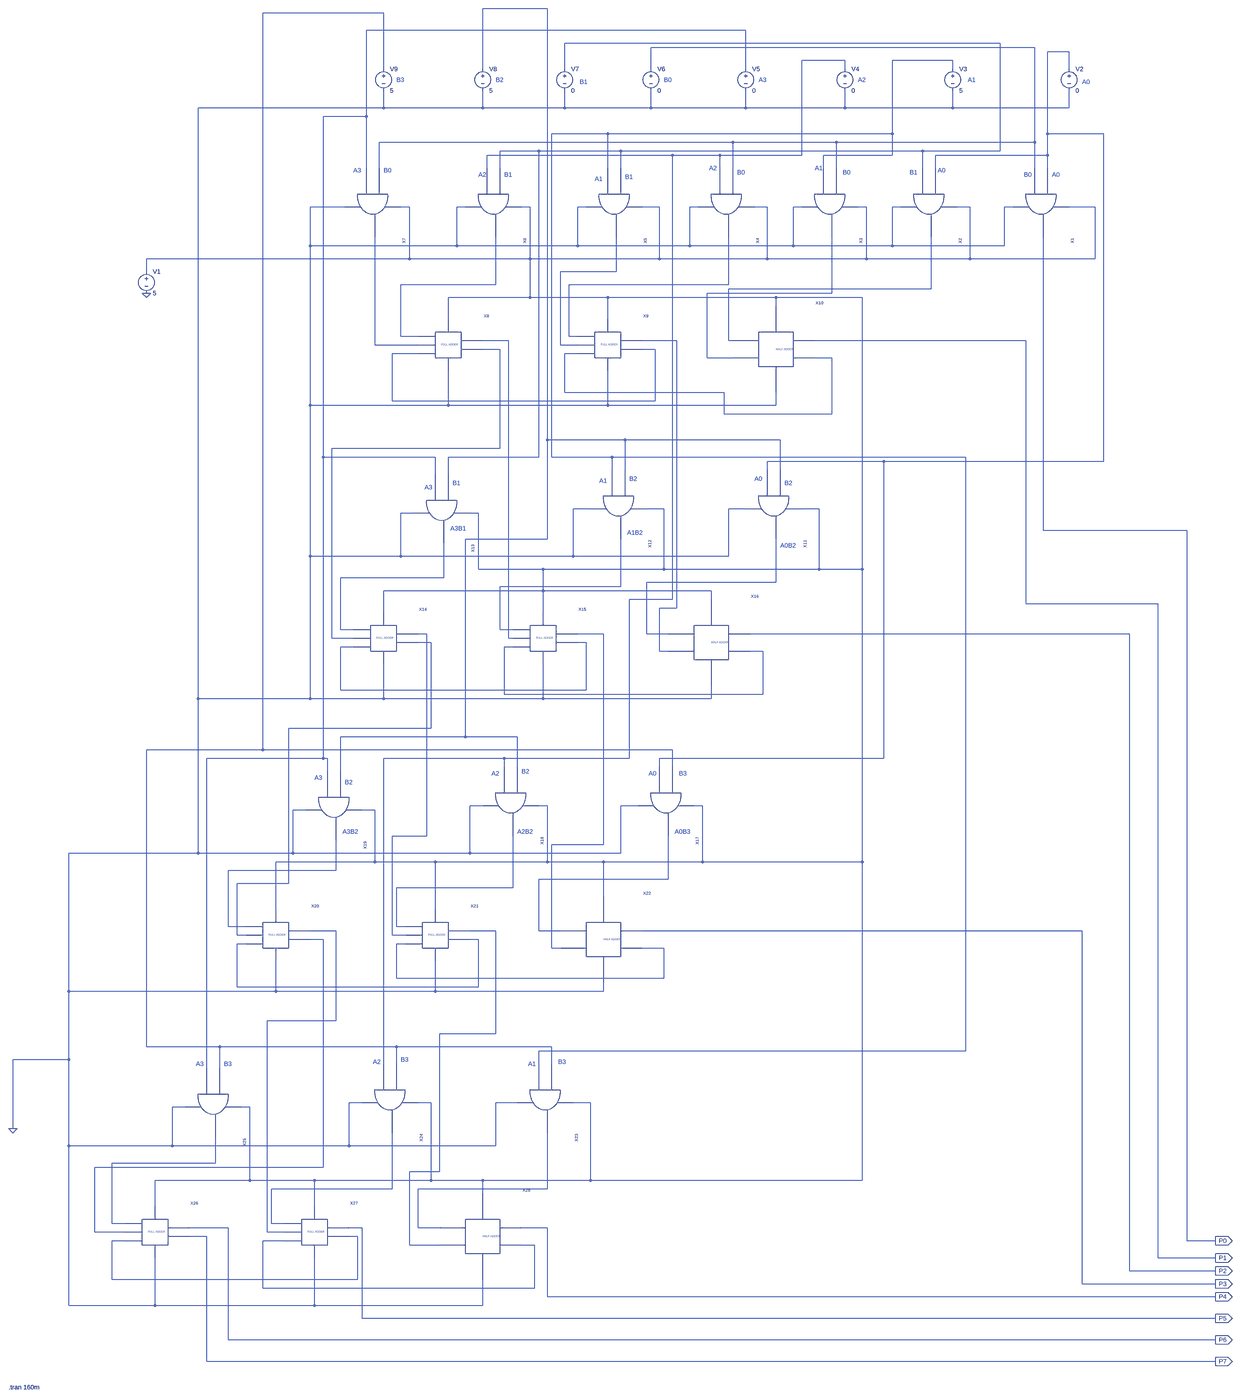
[diagram p0: schematic 4bitmultipliertesting.asc, whole sheet]
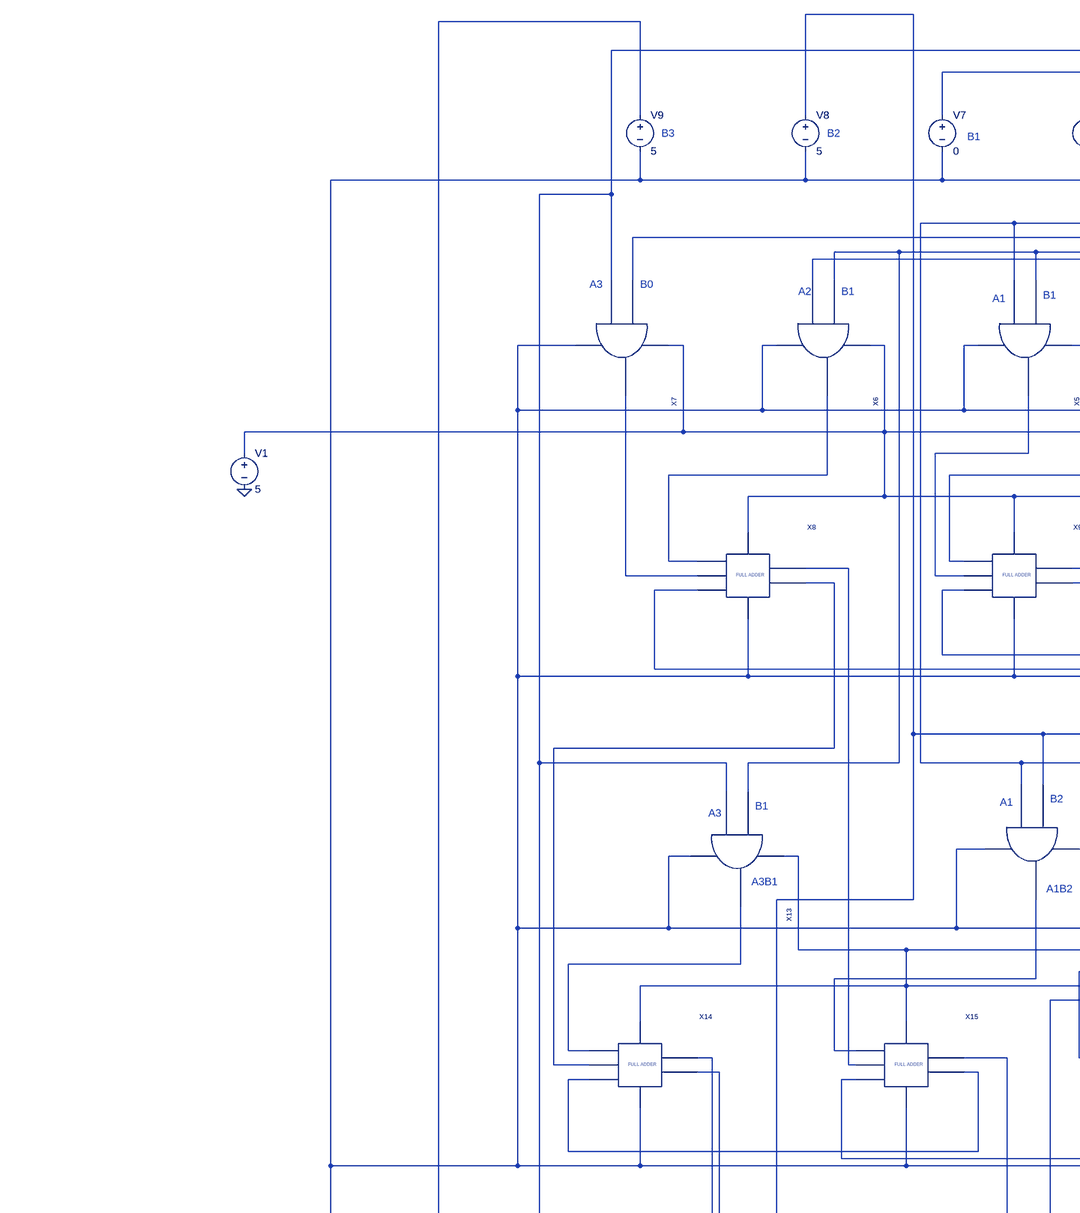
[diagram p1: schematic 4bitmultipliertesting.asc, part, row 1 of 2, column 1 of 2]
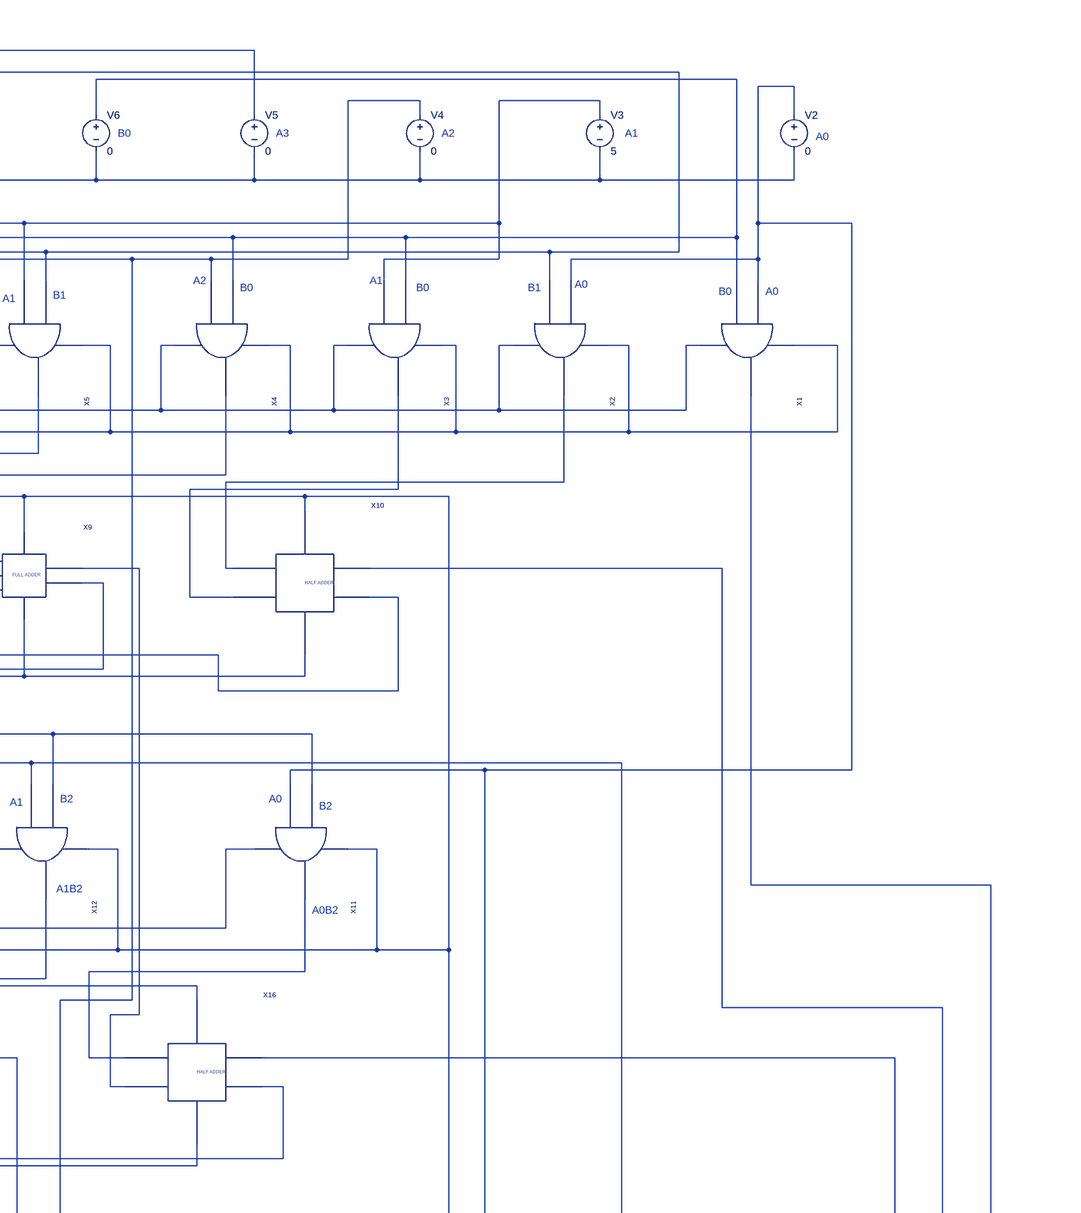
[diagram p2: schematic 4bitmultipliertesting.asc, part, row 1 of 2, column 2 of 2]
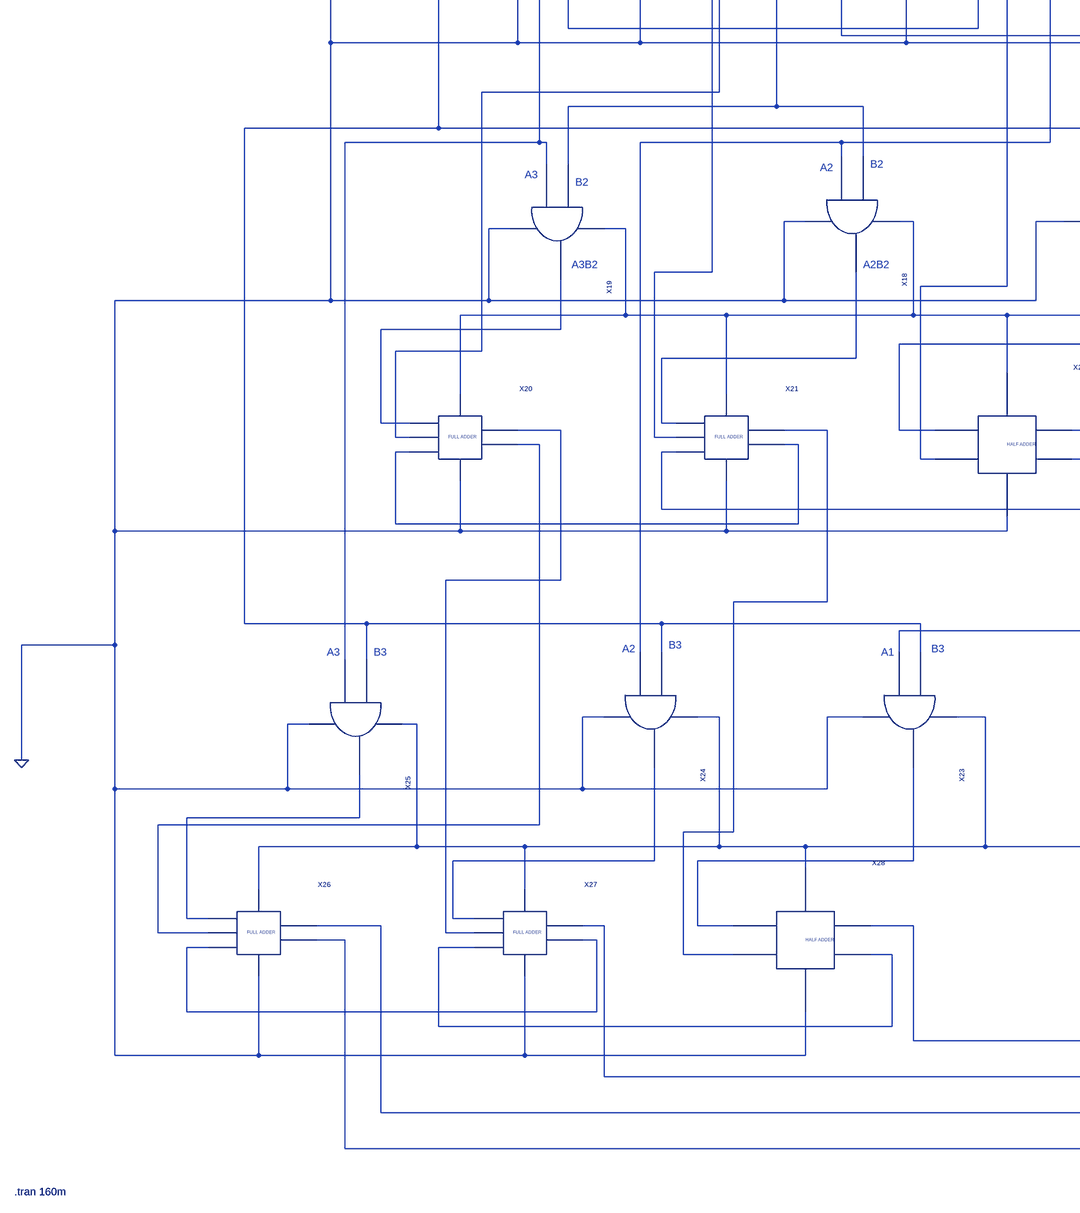
[diagram p3: schematic 4bitmultipliertesting.asc, part, row 2 of 2, column 1 of 2]
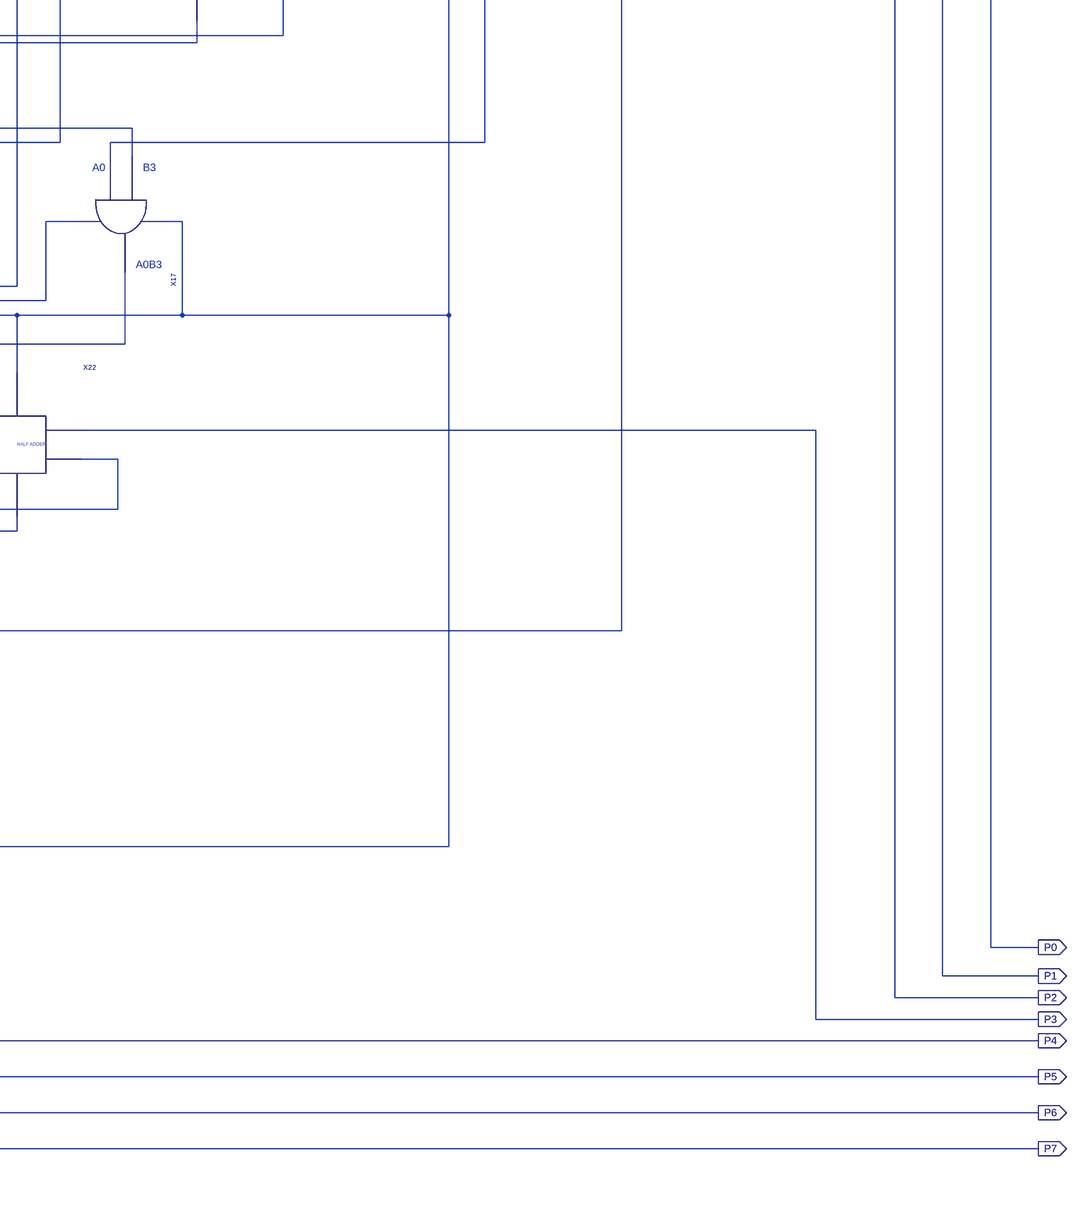
[diagram p4: schematic 4bitmultipliertesting.asc, part, row 2 of 2, column 2 of 2]
4bitmultipliertesting.asc, the LTspice schematic file:
Version 4
SHEET 1 880 680
WIRE -5856 -4944 -6096 -4944
WIRE -6464 -4928 -6912 -4928
WIRE -5120 -4864 -6528 -4864
WIRE -4176 -4816 -5792 -4816
WIRE -4048 -4800 -5472 -4800
WIRE -3920 -4784 -4000 -4784
WIRE -4752 -4752 -4912 -4752
WIRE -4352 -4752 -4576 -4752
WIRE -6464 -4720 -6464 -4928
WIRE -6096 -4720 -6096 -4944
WIRE -5792 -4720 -5792 -4816
WIRE -5472 -4720 -5472 -4800
WIRE -5120 -4720 -5120 -4864
WIRE -4752 -4720 -4752 -4752
WIRE -4352 -4720 -4352 -4752
WIRE -3920 -4720 -3920 -4784
WIRE -6464 -4576 -6464 -4640
WIRE -6464 -4576 -7152 -4576
WIRE -6096 -4576 -6096 -4640
WIRE -6096 -4576 -6464 -4576
WIRE -5792 -4576 -5792 -4640
WIRE -5792 -4576 -6096 -4576
WIRE -5472 -4576 -5472 -4640
WIRE -5472 -4576 -5792 -4576
WIRE -5120 -4576 -5120 -4640
WIRE -5120 -4576 -5472 -4576
WIRE -4752 -4576 -4752 -4640
WIRE -4752 -4576 -5120 -4576
WIRE -4352 -4576 -4352 -4640
WIRE -4352 -4576 -4752 -4576
WIRE -3920 -4576 -3920 -4640
WIRE -3920 -4576 -4352 -4576
WIRE -6528 -4544 -6528 -4864
WIRE -6528 -4544 -6688 -4544
WIRE -5632 -4480 -5840 -4480
WIRE -4576 -4480 -4576 -4752
WIRE -4576 -4480 -5632 -4480
WIRE -4000 -4480 -4000 -4784
WIRE -3792 -4480 -4000 -4480
WIRE -5168 -4448 -6480 -4448
WIRE -4784 -4448 -5168 -4448
WIRE -4048 -4448 -4048 -4800
WIRE -4048 -4448 -4784 -4448
WIRE -5888 -4416 -6032 -4416
WIRE -5584 -4416 -5888 -4416
WIRE -4464 -4416 -5584 -4416
WIRE -4176 -4416 -4176 -4816
WIRE -4176 -4416 -4464 -4416
WIRE -5392 -4400 -6080 -4400
WIRE -5216 -4400 -5392 -4400
WIRE -4912 -4400 -4912 -4752
WIRE -4912 -4400 -5216 -4400
WIRE -4576 -4400 -4576 -4480
WIRE -4576 -4400 -4832 -4400
WIRE -4000 -4400 -4000 -4480
WIRE -4000 -4400 -4416 -4400
WIRE -6528 -4352 -6528 -4544
WIRE -6480 -4352 -6480 -4448
WIRE -6080 -4352 -6080 -4400
WIRE -6032 -4352 -6032 -4416
WIRE -5632 -4352 -5632 -4480
WIRE -5584 -4352 -5584 -4416
WIRE -5216 -4352 -5216 -4400
WIRE -5168 -4352 -5168 -4448
WIRE -4832 -4352 -4832 -4400
WIRE -4784 -4352 -4784 -4448
WIRE -4464 -4352 -4464 -4416
WIRE -4416 -4352 -4416 -4400
WIRE -4048 -4352 -4048 -4448
WIRE -4000 -4352 -4000 -4400
WIRE -6608 -4208 -6736 -4208
WIRE -6368 -4208 -6400 -4208
WIRE -6160 -4208 -6192 -4208
WIRE -5920 -4208 -5952 -4208
WIRE -5712 -4208 -5744 -4208
WIRE -5440 -4208 -5504 -4208
WIRE -5296 -4208 -5328 -4208
WIRE -5040 -4208 -5088 -4208
WIRE -4912 -4208 -4944 -4208
WIRE -4672 -4208 -4704 -4208
WIRE -4544 -4208 -4576 -4208
WIRE -4288 -4208 -4336 -4208
WIRE -4128 -4208 -4160 -4208
WIRE -3824 -4208 -3920 -4208
WIRE -6736 -4064 -6736 -4208
WIRE -6192 -4064 -6192 -4208
WIRE -6192 -4064 -6736 -4064
WIRE -5744 -4064 -5744 -4208
WIRE -5744 -4064 -6192 -4064
WIRE -5328 -4064 -5328 -4208
WIRE -5328 -4064 -5744 -4064
WIRE -4944 -4064 -4944 -4208
WIRE -4944 -4064 -5328 -4064
WIRE -4576 -4064 -4576 -4208
WIRE -4576 -4064 -4944 -4064
WIRE -4160 -4064 -4160 -4208
WIRE -4160 -4064 -4576 -4064
WIRE -6368 -4016 -6368 -4208
WIRE -6368 -4016 -7344 -4016
WIRE -5920 -4016 -5920 -4208
WIRE -5920 -4016 -6368 -4016
WIRE -5440 -4016 -5440 -4208
WIRE -5440 -4016 -5920 -4016
WIRE -5040 -4016 -5040 -4208
WIRE -5040 -4016 -5440 -4016
WIRE -4672 -4016 -4672 -4208
WIRE -4672 -4016 -5040 -4016
WIRE -4288 -4016 -4288 -4208
WIRE -4288 -4016 -4672 -4016
WIRE -3824 -4016 -3824 -4208
WIRE -3824 -4016 -4288 -4016
WIRE -7344 -3968 -7344 -4016
WIRE -5600 -3968 -5600 -4096
WIRE -5600 -3968 -5808 -3968
WIRE -6048 -3920 -6048 -4096
WIRE -6048 -3920 -6400 -3920
WIRE -5184 -3920 -5184 -4096
WIRE -5184 -3920 -5776 -3920
WIRE -4432 -3904 -4432 -4096
WIRE -4432 -3904 -5184 -3904
WIRE -4800 -3888 -4800 -4096
WIRE -4800 -3888 -5264 -3888
WIRE -5920 -3872 -5920 -4016
WIRE -5920 -3872 -6224 -3872
WIRE -5632 -3872 -5920 -3872
WIRE -5008 -3872 -5632 -3872
WIRE -4688 -3872 -5008 -3872
WIRE -5008 -3840 -5008 -3872
WIRE -6224 -3792 -6224 -3872
WIRE -5632 -3792 -5632 -3872
WIRE -6400 -3728 -6400 -3920
WIRE -6336 -3728 -6400 -3728
WIRE -5776 -3728 -5776 -3920
WIRE -5744 -3728 -5776 -3728
WIRE -6000 -3712 -6096 -3712
WIRE -5376 -3712 -5504 -3712
WIRE -5184 -3712 -5184 -3904
WIRE -5168 -3712 -5184 -3712
WIRE -4080 -3712 -4864 -3712
WIRE -6496 -3696 -6496 -4096
WIRE -6336 -3696 -6496 -3696
WIRE -5808 -3696 -5808 -3968
WIRE -5744 -3696 -5808 -3696
WIRE -6032 -3680 -6096 -3680
WIRE -5456 -3680 -5504 -3680
WIRE -6336 -3664 -6432 -3664
WIRE -5744 -3664 -5792 -3664
WIRE -5264 -3648 -5264 -3888
WIRE -5168 -3648 -5264 -3648
WIRE -4800 -3648 -4864 -3648
WIRE -5792 -3520 -5792 -3664
WIRE -5200 -3520 -5792 -3520
WIRE -6432 -3488 -6432 -3664
WIRE -5456 -3488 -5456 -3680
WIRE -5456 -3488 -6432 -3488
WIRE -6736 -3472 -6736 -4064
WIRE -6224 -3472 -6224 -3600
WIRE -6224 -3472 -6736 -3472
WIRE -5632 -3472 -5632 -3600
WIRE -5632 -3472 -6224 -3472
WIRE -5008 -3472 -5008 -3520
WIRE -5008 -3472 -5632 -3472
WIRE -5200 -3440 -5200 -3520
WIRE -4800 -3440 -4800 -3648
WIRE -4800 -3440 -5200 -3440
WIRE -5856 -3344 -5856 -4944
WIRE -5568 -3344 -5856 -3344
WIRE -4992 -3344 -5568 -3344
WIRE -6032 -3312 -6032 -3680
WIRE -6032 -3312 -6656 -3312
WIRE -6688 -3280 -6688 -4544
WIRE -6272 -3280 -6688 -3280
WIRE -5888 -3280 -5888 -4416
WIRE -5888 -3280 -6224 -3280
WIRE -5840 -3280 -5840 -4480
WIRE -5616 -3280 -5840 -3280
WIRE -4304 -3280 -5616 -3280
WIRE -4608 -3264 -5040 -3264
WIRE -3792 -3264 -3792 -4480
WIRE -3792 -3264 -4608 -3264
WIRE -5616 -3232 -5616 -3280
WIRE -5568 -3232 -5568 -3344
WIRE -5040 -3232 -5040 -3264
WIRE -4992 -3232 -4992 -3344
WIRE -6272 -3216 -6272 -3280
WIRE -6224 -3216 -6224 -3280
WIRE -5696 -3088 -5760 -3088
WIRE -5424 -3088 -5488 -3088
WIRE -5120 -3088 -5184 -3088
WIRE -4848 -3088 -4912 -3088
WIRE -6352 -3072 -6400 -3072
WIRE -6112 -3072 -6144 -3072
WIRE -4016 -3008 -4016 -4096
WIRE -3056 -3008 -4016 -3008
WIRE -5856 -2976 -5856 -3344
WIRE -5856 -2976 -6160 -2976
WIRE -6736 -2912 -6736 -3472
WIRE -6400 -2912 -6400 -3072
WIRE -6400 -2912 -6736 -2912
WIRE -5760 -2912 -5760 -3088
WIRE -5760 -2912 -6400 -2912
WIRE -5184 -2912 -5184 -3088
WIRE -5184 -2912 -5760 -2912
WIRE -6112 -2864 -6112 -3072
WIRE -5872 -2864 -6112 -2864
WIRE -5424 -2864 -5424 -3088
WIRE -5424 -2864 -5872 -2864
WIRE -4848 -2864 -4848 -3088
WIRE -4848 -2864 -5424 -2864
WIRE -4688 -2864 -4688 -3872
WIRE -4688 -2864 -4848 -2864
WIRE -6240 -2832 -6240 -2960
WIRE -6240 -2832 -6624 -2832
WIRE -5008 -2816 -5008 -2976
WIRE -5008 -2816 -5488 -2816
WIRE -5584 -2800 -5584 -2976
WIRE -5584 -2800 -6032 -2800
WIRE -5872 -2784 -5872 -2864
WIRE -5872 -2784 -6464 -2784
WIRE -5248 -2784 -5872 -2784
WIRE -5392 -2752 -5392 -4400
WIRE -5392 -2752 -5552 -2752
WIRE -5248 -2752 -5248 -2784
WIRE -4080 -2736 -4080 -3712
WIRE -3424 -2736 -4080 -2736
WIRE -5376 -2720 -5376 -3712
WIRE -5376 -2720 -5440 -2720
WIRE -6464 -2704 -6464 -2784
WIRE -5872 -2704 -5872 -2784
WIRE -6624 -2640 -6624 -2832
WIRE -6576 -2640 -6624 -2640
WIRE -6032 -2640 -6032 -2800
WIRE -5984 -2640 -6032 -2640
WIRE -6304 -2624 -6336 -2624
WIRE -5648 -2624 -5744 -2624
WIRE -5488 -2624 -5488 -2816
WIRE -5408 -2624 -5488 -2624
WIRE -3696 -2624 -5104 -2624
WIRE -6656 -2608 -6656 -3312
WIRE -6576 -2608 -6656 -2608
WIRE -6000 -2608 -6000 -3712
WIRE -5984 -2608 -6000 -2608
WIRE -6288 -2592 -6336 -2592
WIRE -5712 -2592 -5744 -2592
WIRE -6576 -2576 -6624 -2576
WIRE -5984 -2576 -6016 -2576
WIRE -5440 -2560 -5440 -2720
WIRE -5408 -2560 -5440 -2560
WIRE -5056 -2560 -5104 -2560
WIRE -6624 -2416 -6624 -2576
WIRE -5712 -2416 -5712 -2592
WIRE -5712 -2416 -6624 -2416
WIRE -6016 -2400 -6016 -2576
WIRE -5056 -2400 -5056 -2560
WIRE -5056 -2400 -6016 -2400
WIRE -7152 -2384 -7152 -4576
WIRE -6736 -2384 -6736 -2912
WIRE -6736 -2384 -7152 -2384
WIRE -6464 -2384 -6464 -2512
WIRE -6464 -2384 -6736 -2384
WIRE -5872 -2384 -5872 -2512
WIRE -5872 -2384 -6464 -2384
WIRE -5248 -2384 -5248 -2432
WIRE -5248 -2384 -5872 -2384
WIRE -6288 -2256 -6288 -2592
WIRE -6288 -2256 -6816 -2256
WIRE -6160 -2224 -6160 -2976
WIRE -6160 -2224 -6624 -2224
WIRE -5968 -2224 -6160 -2224
WIRE -6912 -2176 -6912 -4928
WIRE -6912 -2176 -7344 -2176
WIRE -5392 -2176 -6912 -2176
WIRE -6688 -2144 -6688 -3280
WIRE -6688 -2144 -7120 -2144
WIRE -6672 -2144 -6688 -2144
WIRE -6016 -2144 -6464 -2144
WIRE -5552 -2144 -5552 -2752
WIRE -5552 -2144 -6016 -2144
WIRE -4608 -2144 -4608 -3264
WIRE -4608 -2144 -5440 -2144
WIRE -6016 -2112 -6016 -2144
WIRE -5968 -2112 -5968 -2224
WIRE -5440 -2112 -5440 -2144
WIRE -5392 -2112 -5392 -2176
WIRE -6672 -2096 -6672 -2144
WIRE -6624 -2096 -6624 -2224
WIRE -6096 -1968 -6144 -1968
WIRE -5856 -1968 -5888 -1968
WIRE -5520 -1968 -5584 -1968
WIRE -5280 -1968 -5312 -1968
WIRE -6752 -1952 -6800 -1952
WIRE -6496 -1952 -6544 -1952
WIRE -6304 -1856 -6304 -2624
WIRE -6304 -1856 -6432 -1856
WIRE -5648 -1824 -5648 -2624
WIRE -5648 -1824 -5840 -1824
WIRE -7152 -1792 -7152 -2384
WIRE -7152 -1792 -7632 -1792
WIRE -6800 -1792 -6800 -1952
WIRE -6800 -1792 -7152 -1792
WIRE -6144 -1792 -6144 -1968
WIRE -6144 -1792 -6800 -1792
WIRE -5584 -1792 -5584 -1968
WIRE -5584 -1792 -6144 -1792
WIRE -6496 -1760 -6496 -1952
WIRE -6496 -1760 -6864 -1760
WIRE -6272 -1760 -6496 -1760
WIRE -5856 -1760 -5856 -1968
WIRE -5856 -1760 -6272 -1760
WIRE -5648 -1760 -5856 -1760
WIRE -5280 -1760 -5280 -1968
WIRE -5280 -1760 -5648 -1760
WIRE -4688 -1760 -4688 -2864
WIRE -4688 -1760 -5280 -1760
WIRE -6640 -1728 -6640 -1840
WIRE -6640 -1728 -7040 -1728
WIRE -5408 -1696 -5408 -1856
WIRE -5408 -1696 -5888 -1696
WIRE -6816 -1680 -6816 -2256
WIRE -6816 -1680 -7008 -1680
WIRE -5984 -1664 -5984 -1856
WIRE -5984 -1664 -6416 -1664
WIRE -5648 -1632 -5648 -1760
WIRE -6864 -1584 -6864 -1760
WIRE -6272 -1584 -6272 -1760
WIRE -7040 -1520 -7040 -1728
WIRE -6976 -1520 -7040 -1520
WIRE -6416 -1520 -6416 -1664
WIRE -6384 -1520 -6416 -1520
WIRE -6640 -1504 -6736 -1504
WIRE -6048 -1504 -6144 -1504
WIRE -5888 -1504 -5888 -1696
WIRE -5808 -1504 -5888 -1504
WIRE -3872 -1504 -5504 -1504
WIRE -7008 -1488 -7008 -1680
WIRE -6976 -1488 -7008 -1488
WIRE -6432 -1488 -6432 -1856
WIRE -6384 -1488 -6432 -1488
WIRE -6688 -1472 -6736 -1472
WIRE -6112 -1472 -6144 -1472
WIRE -6976 -1456 -7008 -1456
WIRE -6384 -1456 -6416 -1456
WIRE -5840 -1440 -5840 -1824
WIRE -5808 -1440 -5840 -1440
WIRE -5424 -1440 -5504 -1440
WIRE -6416 -1328 -6416 -1456
WIRE -5424 -1328 -5424 -1440
WIRE -5424 -1328 -6416 -1328
WIRE -7008 -1296 -7008 -1456
WIRE -6112 -1296 -6112 -1472
WIRE -6112 -1296 -7008 -1296
WIRE -7632 -1280 -7632 -1792
WIRE -6864 -1280 -6864 -1392
WIRE -6864 -1280 -7632 -1280
WIRE -6272 -1280 -6272 -1392
WIRE -6272 -1280 -6864 -1280
WIRE -5648 -1280 -5648 -1312
WIRE -5648 -1280 -6272 -1280
WIRE -6640 -1152 -6640 -1504
WIRE -6640 -1152 -6896 -1152
WIRE -6048 -1104 -6048 -1504
WIRE -6048 -1104 -6256 -1104
WIRE -7344 -1056 -7344 -2176
WIRE -7072 -1056 -7344 -1056
WIRE -6416 -1056 -7072 -1056
WIRE -5840 -1056 -6416 -1056
WIRE -4304 -1040 -4304 -3280
WIRE -4304 -1040 -5888 -1040
WIRE -7632 -1008 -7632 -1280
WIRE -7632 -1008 -8256 -1008
WIRE -6464 -992 -6464 -2144
WIRE -6416 -992 -6416 -1056
WIRE -5888 -992 -5888 -1040
WIRE -5840 -992 -5840 -1056
WIRE -7120 -976 -7120 -2144
WIRE -7072 -976 -7072 -1056
WIRE -6544 -848 -6592 -848
WIRE -6288 -848 -6336 -848
WIRE -5968 -848 -6048 -848
WIRE -5696 -848 -5760 -848
WIRE -7200 -832 -7248 -832
WIRE -6960 -832 -6992 -832
WIRE -8256 -752 -8256 -1008
WIRE -7632 -688 -7632 -1008
WIRE -7248 -688 -7248 -832
WIRE -7248 -688 -7632 -688
WIRE -6592 -688 -6592 -848
WIRE -6592 -688 -7248 -688
WIRE -6048 -688 -6048 -848
WIRE -6048 -688 -6592 -688
WIRE -7088 -624 -7088 -720
WIRE -7088 -624 -7472 -624
WIRE -6688 -608 -6688 -1472
WIRE -6688 -608 -7536 -608
WIRE -6256 -592 -6256 -1104
WIRE -6256 -592 -6368 -592
WIRE -6960 -560 -6960 -832
WIRE -6960 -560 -7312 -560
WIRE -6720 -560 -6960 -560
WIRE -6288 -560 -6288 -848
WIRE -6288 -560 -6720 -560
WIRE -6096 -560 -6288 -560
WIRE -5696 -560 -5696 -848
WIRE -5696 -560 -6096 -560
WIRE -4688 -560 -4688 -1760
WIRE -4688 -560 -5696 -560
WIRE -6432 -528 -6432 -736
WIRE -6432 -528 -6880 -528
WIRE -5856 -528 -5856 -736
WIRE -5856 -528 -6336 -528
WIRE -6096 -512 -6096 -560
WIRE -7312 -464 -7312 -560
WIRE -6720 -464 -6720 -560
WIRE -7472 -400 -7472 -624
WIRE -7424 -400 -7472 -400
WIRE -6880 -400 -6880 -528
WIRE -6832 -400 -6880 -400
WIRE -7040 -384 -7184 -384
WIRE -6544 -384 -6592 -384
WIRE -6336 -384 -6336 -528
WIRE -6256 -384 -6336 -384
WIRE -5856 -384 -5952 -384
WIRE -7536 -368 -7536 -608
WIRE -7424 -368 -7536 -368
WIRE -6896 -368 -6896 -1152
WIRE -6832 -368 -6896 -368
WIRE -7120 -352 -7184 -352
WIRE -6560 -352 -6592 -352
WIRE -7424 -336 -7472 -336
WIRE -6832 -336 -6912 -336
WIRE -3056 -336 -3056 -3008
WIRE -2784 -336 -3056 -336
WIRE -6368 -320 -6368 -592
WIRE -6256 -320 -6368 -320
WIRE -5904 -320 -5952 -320
WIRE -3424 -272 -3424 -2736
WIRE -2784 -272 -3424 -272
WIRE -3696 -224 -3696 -2624
WIRE -2784 -224 -3696 -224
WIRE -7472 -192 -7472 -336
WIRE -6560 -192 -6560 -352
WIRE -6560 -192 -7472 -192
WIRE -3872 -176 -3872 -1504
WIRE -2784 -176 -3872 -176
WIRE -6912 -160 -6912 -336
WIRE -5904 -160 -5904 -320
WIRE -5904 -160 -6912 -160
WIRE -5856 -128 -5856 -384
WIRE -2784 -128 -5856 -128
WIRE -7632 -96 -7632 -688
WIRE -7312 -96 -7312 -272
WIRE -7312 -96 -7632 -96
WIRE -6720 -96 -6720 -272
WIRE -6720 -96 -7312 -96
WIRE -6096 -96 -6096 -192
WIRE -6096 -96 -6720 -96
WIRE -6544 -48 -6544 -384
WIRE -2784 -48 -6544 -48
WIRE -7040 32 -7040 -384
WIRE -2784 32 -7040 32
WIRE -7120 112 -7120 -352
WIRE -2784 112 -7120 112
FLAG -8256 -752 0
FLAG -7344 -3888 0
FLAG -2784 -336 P0
IOPIN -2784 -336 Out
FLAG -2784 -272 P1
IOPIN -2784 -272 Out
FLAG -2784 -224 P2
IOPIN -2784 -224 Out
FLAG -2784 -176 P3
IOPIN -2784 -176 Out
FLAG -2784 -128 P4
IOPIN -2784 -128 Out
FLAG -2784 -48 P5
IOPIN -2784 -48 Out
FLAG -2784 32 P6
IOPIN -2784 32 Out
FLAG -2784 112 P7
IOPIN -2784 112 Out
SYMBOL andgateimply -4016 -4320 R90
SYMATTR InstName X1
SYMBOL andgateimply -4432 -4320 R90
SYMATTR InstName X2
SYMBOL andgateimply -4800 -4320 R90
SYMATTR InstName X3
SYMBOL andgateimply -5184 -4320 R90
SYMATTR InstName X4
SYMBOL andgateimply -5600 -4320 R90
SYMATTR InstName X5
SYMBOL andgateimply -6048 -4320 R90
SYMATTR InstName X6
SYMBOL andgateimply -6496 -4320 R90
SYMATTR InstName X7
SYMBOL fulladderimply -6224 -3696 R0
SYMATTR InstName X8
SYMBOL fulladderimply -5632 -3696 R0
SYMATTR InstName X9
SYMBOL halfadderimply -5024 -3680 R0
SYMATTR InstName X10
SYMBOL andgateimply -5008 -3200 R90
SYMATTR InstName X11
SYMBOL andgateimply -5584 -3200 R90
SYMATTR InstName X12
SYMBOL andgateimply -6240 -3184 R90
SYMATTR InstName X13
SYMBOL fulladderimply -6464 -2608 R0
SYMATTR InstName X14
SYMBOL fulladderimply -5872 -2608 R0
SYMATTR InstName X15
SYMBOL halfadderimply -5264 -2592 R0
SYMATTR InstName X16
SYMBOL andgateimply -5408 -2080 R90
SYMATTR InstName X17
SYMBOL andgateimply -5984 -2080 R90
SYMATTR InstName X18
SYMBOL andgateimply -6640 -2064 R90
SYMATTR InstName X19
SYMBOL fulladderimply -6864 -1488 R0
SYMATTR InstName X20
SYMBOL fulladderimply -6272 -1488 R0
SYMATTR InstName X21
SYMBOL halfadderimply -5664 -1472 R0
SYMATTR InstName X22
SYMBOL andgateimply -5856 -960 R90
SYMATTR InstName X23
SYMBOL andgateimply -6432 -960 R90
SYMATTR InstName X24
SYMBOL andgateimply -7088 -944 R90
SYMATTR InstName X25
SYMBOL fulladderimply -7312 -368 R0
SYMATTR InstName X26
SYMBOL fulladderimply -6720 -368 R0
SYMATTR InstName X27
SYMBOL halfadderimply -6112 -352 R0
SYMATTR InstName X28
SYMBOL voltage -7344 -3984 R0
WINDOW 123 0 0 Left 0
WINDOW 39 0 0 Left 0
SYMATTR InstName V1
SYMATTR Value 5
SYMBOL voltage -3920 -4736 R0
WINDOW 123 0 0 Left 0
WINDOW 39 0 0 Left 0
SYMATTR InstName V2
SYMATTR Value 0
SYMBOL voltage -4352 -4736 R0
WINDOW 123 0 0 Left 0
WINDOW 39 0 0 Left 0
SYMATTR InstName V3
SYMATTR Value 5
SYMBOL voltage -4752 -4736 R0
WINDOW 123 0 0 Left 0
WINDOW 39 0 0 Left 0
SYMATTR InstName V4
SYMATTR Value 0
SYMBOL voltage -5120 -4736 R0
WINDOW 123 0 0 Left 0
WINDOW 39 0 0 Left 0
SYMATTR InstName V5
SYMATTR Value 0
SYMBOL voltage -5472 -4736 R0
WINDOW 123 0 0 Left 0
WINDOW 39 0 0 Left 0
SYMATTR InstName V6
SYMATTR Value 0
SYMBOL voltage -5792 -4736 R0
WINDOW 123 0 0 Left 0
WINDOW 39 0 0 Left 0
SYMATTR InstName V7
SYMATTR Value 0
SYMBOL voltage -6096 -4736 R0
WINDOW 123 0 0 Left 0
WINDOW 39 0 0 Left 0
SYMATTR InstName V8
SYMATTR Value 5
SYMBOL voltage -6464 -4736 R0
WINDOW 123 0 0 Left 0
WINDOW 39 0 0 Left 0
SYMATTR InstName V9
SYMATTR Value 5
TEXT -3872 -4672 Left 2 ;A0
TEXT -4296 -4680 Left 2 ;A1
TEXT -4704 -4680 Left 2 ;A2
TEXT -5072 -4680 Left 2 ;A3
TEXT -5424 -4680 Left 2 ;B0
TEXT -5736 -4672 Left 2 ;B1
TEXT -6048 -4680 Left 2 ;B2
TEXT -6416 -4680 Left 2 ;B3
TEXT -3984 -4328 Left 2 ;A0
TEXT -4088 -4328 Left 2 ;B0
TEXT -4408 -4344 Left 2 ;A0
TEXT -4512 -4336 Left 2 ;B1
TEXT -4760 -4336 Left 2 ;B0
TEXT -4864 -4352 Left 2 ;A1
TEXT -5256 -4352 Left 2 ;A2
TEXT -5152 -4336 Left 2 ;B0
TEXT -6576 -4344 Left 2 ;A3
TEXT -6464 -4344 Left 2 ;B0
TEXT -6112 -4328 Left 2 ;A2
TEXT -6016 -4328 Left 2 ;B1
TEXT -5680 -4312 Left 2 ;A1
TEXT -5568 -4320 Left 2 ;B1
TEXT -4992 -2952 Left 2 ;A0B2
TEXT -5560 -3000 Left 2 ;A1B2
TEXT -6216 -3016 Left 2 ;A3B1
TEXT -6312 -3168 Left 2 ;A3
TEXT -6208 -3184 Left 2 ;B1
TEXT -5664 -3192 Left 2 ;A1
TEXT -5552 -3200 Left 2 ;B2
TEXT -4976 -3184 Left 2 ;B2
TEXT -5088 -3200 Left 2 ;A0
TEXT -5480 -2088 Left 2 ;A0
TEXT -6064 -2088 Left 2 ;A2
TEXT -6720 -2072 Left 2 ;A3
TEXT -6608 -2056 Left 2 ;B2
TEXT -5952 -2096 Left 2 ;B2
TEXT -5368 -2088 Left 2 ;B3
TEXT -6616 -1872 Left 2 ;A3B2
TEXT -5968 -1872 Left 2 ;A2B2
TEXT -5384 -1872 Left 2 ;A0B3
TEXT -7056 -992 Left 2 ;B3
TEXT -6400 -1008 Left 2 ;B3
TEXT -5816 -1000 Left 2 ;B3
TEXT -5928 -992 Left 2 ;A1
TEXT -6504 -1000 Left 2 ;A2
TEXT -7160 -992 Left 2 ;A3
TEXT -8272 208 Left 2 !.tran 160m

The netlist it stands for:
* 4bitmultipliertesting.asc
XX1 N009 0 N006 N005 P0 andgateimply  ; pins VDD VSS A B OUT
XX2 N009 0 N006 N004 N013 andgateimply  ; pins VDD VSS A B OUT
XX3 N009 0 N005 N008 N014 andgateimply  ; pins VDD VSS A B OUT
XX4 N009 0 N005 N007 N012 andgateimply  ; pins VDD VSS A B OUT
XX5 N009 0 N004 N008 N010 andgateimply  ; pins VDD VSS A B OUT
XX6 N009 0 N004 N007 N011 andgateimply  ; pins VDD VSS A B OUT
XX7 N009 0 N005 N003 N017 andgateimply  ; pins VDD VSS A B OUT
XX8 N011 N017 N019 N009 0 N018 N015 fulladderimply  ; pins A B C VDD VSS CARRY SUM
XX9 N012 N010 N020 N009 0 N019 N016 fulladderimply  ; pins A B C VDD VSS CARRY SUM
XX10 N013 N014 N009 0 P1 N020 halfadderimply  ; pins A B VDD VSS SUM COUT
XX11 N009 0 N001 N006 N022 andgateimply  ; pins VDD VSS A B OUT
XX12 N009 0 N001 N008 N023 andgateimply  ; pins VDD VSS A B OUT
XX13 N009 0 N004 N003 N021 andgateimply  ; pins VDD VSS A B OUT
XX14 N021 N018 N027 N009 0 N026 N024 fulladderimply  ; pins A B C VDD VSS CARRY SUM
XX15 N023 N015 N028 N009 0 N027 N025 fulladderimply  ; pins A B C VDD VSS CARRY SUM
XX16 N022 N016 N009 0 P2 N028 halfadderimply  ; pins A B VDD VSS SUM COUT
XX17 N009 0 N002 N006 N030 andgateimply  ; pins VDD VSS A B OUT
XX18 N009 0 N001 N007 N031 andgateimply  ; pins VDD VSS A B OUT
XX19 N009 0 N001 N003 N029 andgateimply  ; pins VDD VSS A B OUT
XX20 N029 N026 N035 N009 0 N034 N032 fulladderimply  ; pins A B C VDD VSS CARRY SUM
XX21 N031 N024 N036 N009 0 N035 N033 fulladderimply  ; pins A B C VDD VSS CARRY SUM
XX22 N030 N025 N009 0 P3 N036 halfadderimply  ; pins A B VDD VSS SUM COUT
XX23 N009 0 N002 N008 N039 andgateimply  ; pins VDD VSS A B OUT
XX24 N009 0 N002 N007 N038 andgateimply  ; pins VDD VSS A B OUT
XX25 N009 0 N002 N003 N037 andgateimply  ; pins VDD VSS A B OUT
XX26 N037 N034 N040 N009 0 P7 P6 fulladderimply  ; pins A B C VDD VSS CARRY SUM
XX27 N038 N032 N041 N009 0 N040 P5 fulladderimply  ; pins A B C VDD VSS CARRY SUM
XX28 N039 N033 N009 0 P4 N041 halfadderimply  ; pins A B VDD VSS SUM COUT
V1 N009 0 5
V2 N006 0 0
V3 N008 0 5
V4 N007 0 0
V5 N003 0 0
V6 N005 0 0
V7 N004 0 0
V8 N001 0 5
V9 N002 0 5
* A0
* A1
* A2
* A3
* B0
* B1
* B2
* B3
* A0
* B0
* A0
* B1
* B0
* A1
* A2
* B0
* A3
* B0
* A2
* B1
* A1
* B1
* A0B2
* A1B2
* A3B1
* A3
* B1
* A1
* B2
* B2
* A0
* A0
* A2
* A3
* B2
* B2
* B3
* A3B2
* A2B2
* A0B3
* B3
* B3
* B3
* A1
* A2
* A3
.tran 160m
.backanno
.end